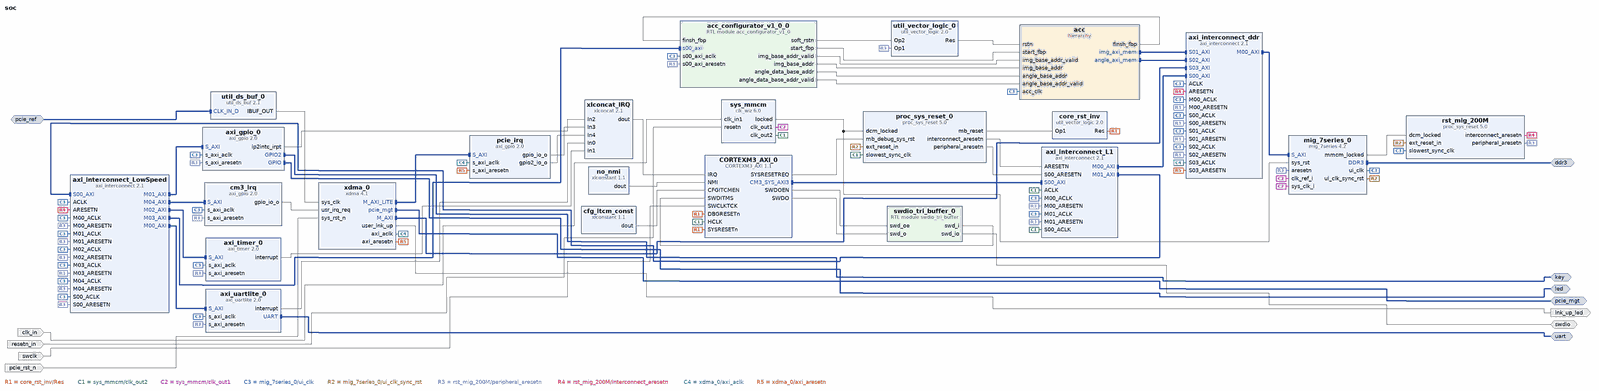
[diagram p0: block diagram of the top level, whole]
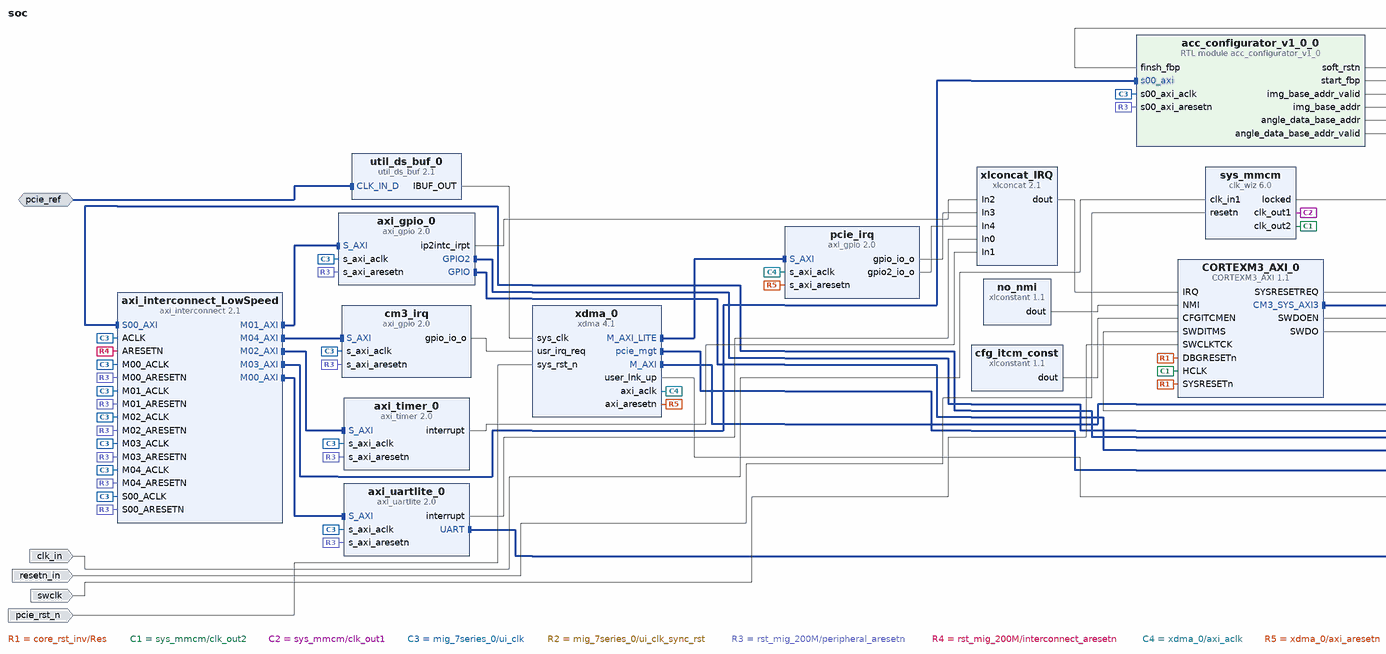
[diagram p1: block diagram of the top level, left part]
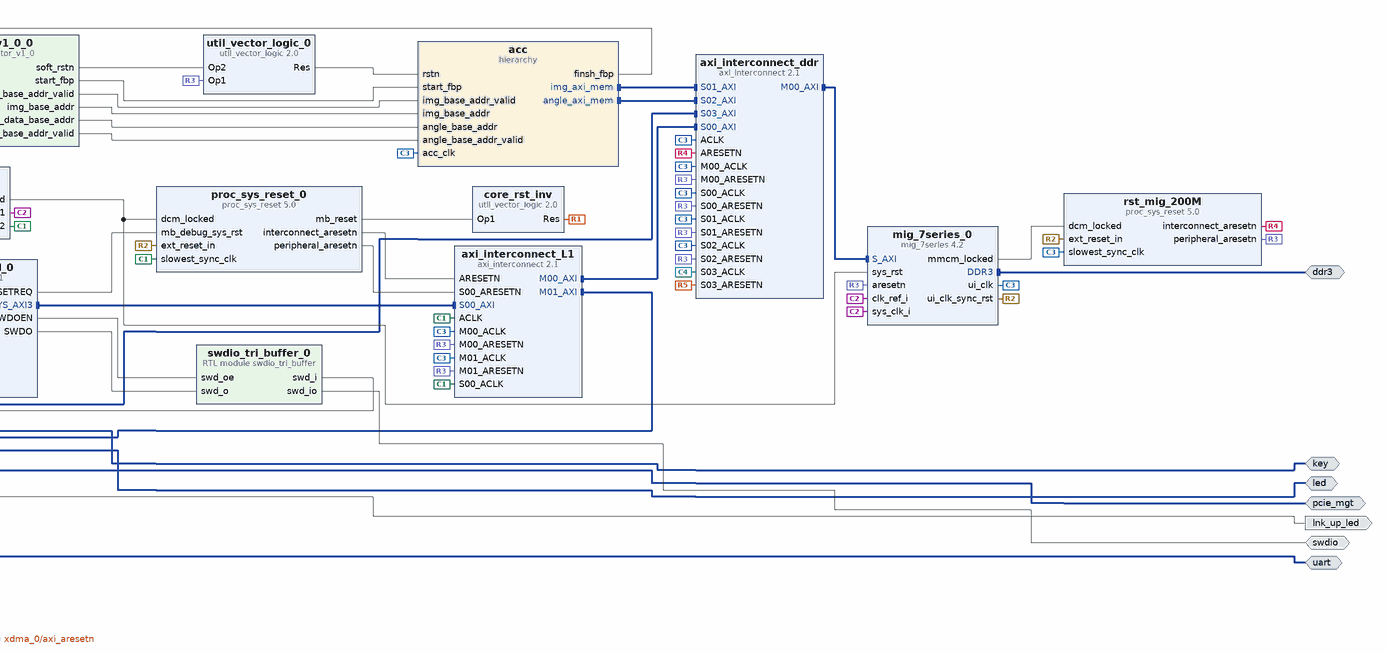
[diagram p2: block diagram of the top level, right part]
# Vivado block design soc, xc7k325tffg676-2, Vivado 2020.2
create_bd_design soc

create_bd_intf_port -mode Master -vlnv xilinx.com:interface:ddrx_rtl:1.0 ddr3
create_bd_intf_port -mode Master -vlnv xilinx.com:interface:pcie_7x_mgt_rtl:1.0 pcie_mgt
create_bd_intf_port -mode Slave -vlnv xilinx.com:interface:diff_clock_rtl:1.0 pcie_ref
set_property -dict {CONFIG.FREQ_HZ 100000000} [get_bd_intf_ports pcie_ref]
create_bd_intf_port -mode Master -vlnv xilinx.com:interface:gpio_rtl:1.0 led
create_bd_intf_port -mode Master -vlnv xilinx.com:interface:gpio_rtl:1.0 key
create_bd_intf_port -mode Master -vlnv xilinx.com:interface:uart_rtl:1.0 uart
create_bd_port -dir I -type clk clk_in
set_property -dict {CONFIG.ASSOCIATED_RESET pcie_rst_n CONFIG.FREQ_HZ 50000000} [get_bd_ports clk_in]
create_bd_port -dir I -type rst resetn_in
create_bd_port -dir I -type clk swclk
create_bd_port -dir IO swdio
create_bd_port -dir O lnk_up_led
create_bd_port -dir I -type rst pcie_rst_n
set_property -dict {CONFIG.POLARITY ACTIVE_LOW} [get_bd_ports pcie_rst_n]

create_bd_cell -type hier acc
create_bd_cell -type ip -vlnv Arm.com:CortexM:CORTEXM3_AXI:1.1 CORTEXM3_AXI_0
set_property -dict [list \
  CONFIG.DTCM_SIZE {"0111"} \
  CONFIG.ITCM_INIT_RAM false \
  CONFIG.ITCM_SIZE {"0111"} \
  CONFIG.JTAG_PRESENT false \
  CONFIG.TRACE_LVL 0 \
] [get_bd_cells CORTEXM3_AXI_0]
create_bd_cell -type module -reference acc_configurator_v1_0 acc_configurator_v1_0_0
create_bd_cell -type ip -vlnv xilinx.com:ip:axi_gpio:2.0 cm3_irq
set_property -dict {CONFIG.C_ALL_OUTPUTS 1 CONFIG.C_GPIO_WIDTH 2 CONFIG.C_IS_DUAL 0} [get_bd_cells cm3_irq]
create_bd_cell -type ip -vlnv xilinx.com:ip:axi_gpio:2.0 axi_gpio_0
set_property -dict [list \
  CONFIG.C_ALL_INPUTS_2 1 \
  CONFIG.C_ALL_OUTPUTS 1 \
  CONFIG.C_GPIO2_WIDTH 4 \
  CONFIG.C_GPIO_WIDTH 7 \
  CONFIG.C_INTERRUPT_PRESENT 1 \
  CONFIG.C_IS_DUAL 1 \
] [get_bd_cells axi_gpio_0]
create_bd_cell -type ip -vlnv xilinx.com:ip:axi_interconnect:2.1 axi_interconnect_L1
create_bd_cell -type ip -vlnv xilinx.com:ip:axi_interconnect:2.1 axi_interconnect_ddr
set_property -dict [list \
  CONFIG.NUM_MI 1 \
  CONFIG.NUM_SI 4 \
  CONFIG.S00_HAS_DATA_FIFO 2 \
  CONFIG.S01_HAS_DATA_FIFO 2 \
  CONFIG.S02_HAS_DATA_FIFO 2 \
  CONFIG.S03_HAS_DATA_FIFO 2 \
  CONFIG.STRATEGY 0 \
] [get_bd_cells axi_interconnect_ddr]
create_bd_cell -type ip -vlnv xilinx.com:ip:axi_timer:2.0 axi_timer_0
create_bd_cell -type ip -vlnv xilinx.com:ip:axi_uartlite:2.0 axi_uartlite_0
set_property -dict {CONFIG.C_BAUDRATE 115200} [get_bd_cells axi_uartlite_0]
create_bd_cell -type ip -vlnv xilinx.com:ip:clk_wiz:6.0 sys_mmcm
set_property -dict [list \
  CONFIG.CLKIN1_JITTER_PS 200.0 \
  CONFIG.CLKOUT1_JITTER 142.107 \
  CONFIG.CLKOUT1_PHASE_ERROR 164.985 \
  CONFIG.CLKOUT1_REQUESTED_OUT_FREQ 200.000 \
  CONFIG.CLKOUT2_JITTER 192.113 \
  CONFIG.CLKOUT2_PHASE_ERROR 164.985 \
  CONFIG.CLKOUT2_REQUESTED_OUT_FREQ 50.000 \
  CONFIG.CLKOUT2_USED true \
  CONFIG.MMCM_CLKFBOUT_MULT_F 20.000 \
  CONFIG.MMCM_CLKIN1_PERIOD 20.000 \
  CONFIG.MMCM_CLKIN2_PERIOD 10.0 \
  CONFIG.MMCM_CLKOUT0_DIVIDE_F 5.000 \
  CONFIG.MMCM_CLKOUT1_DIVIDE 20 \
  CONFIG.NUM_OUT_CLKS 2 \
  CONFIG.PRIM_IN_FREQ 50.000 \
  CONFIG.RESET_PORT resetn \
  CONFIG.RESET_TYPE ACTIVE_LOW \
] [get_bd_cells sys_mmcm]
create_bd_cell -type ip -vlnv xilinx.com:ip:proc_sys_reset:5.0 proc_sys_reset_0
create_bd_cell -type ip -vlnv xilinx.com:ip:proc_sys_reset:5.0 rst_mig_200M
create_bd_cell -type module -reference swdio_tri_buffer swdio_tri_buffer_0
create_bd_cell -type ip -vlnv xilinx.com:ip:util_vector_logic:2.0 core_rst_inv
set_property -dict {CONFIG.C_OPERATION not CONFIG.C_SIZE 1} [get_bd_cells core_rst_inv]
create_bd_cell -type ip -vlnv xilinx.com:ip:util_vector_logic:2.0 util_vector_logic_0
set_property -dict {CONFIG.C_OPERATION and CONFIG.C_SIZE 1} [get_bd_cells util_vector_logic_0]
create_bd_cell -type ip -vlnv xilinx.com:ip:xlconcat:2.1 xlconcat_IRQ
set_property -dict {CONFIG.NUM_PORTS 5 CONFIG.dout_width 5} [get_bd_cells xlconcat_IRQ]
create_bd_cell -type ip -vlnv xilinx.com:ip:xlconstant:1.1 no_nmi
set_property -dict {CONFIG.CONST_VAL 0} [get_bd_cells no_nmi]
create_bd_cell -type ip -vlnv xilinx.com:ip:xlconstant:1.1 cfg_itcm_const
set_property -dict {CONFIG.CONST_WIDTH 2} [get_bd_cells cfg_itcm_const]
create_bd_cell -type ip -vlnv xilinx.com:ip:mig_7series:4.2 mig_7series_0
set_property -dict [list \
  CONFIG.BOARD_MIG_PARAM Custom \
  CONFIG.RESET_BOARD_INTERFACE Custom \
  CONFIG.XML_INPUT_FILE mig_a.prj \
] [get_bd_cells mig_7series_0]
create_bd_cell -type ip -vlnv xilinx.com:ip:util_ds_buf:2.1 util_ds_buf_0
set_property -dict {CONFIG.C_BUF_TYPE IBUFDSGTE} [get_bd_cells util_ds_buf_0]
create_bd_cell -type ip -vlnv xilinx.com:ip:xdma:4.1 xdma_0
set_property -dict [list \
  CONFIG.PF0_DEVICE_ID_mqdma 9024 \
  CONFIG.PF2_DEVICE_ID_mqdma 9024 \
  CONFIG.PF3_DEVICE_ID_mqdma 9024 \
  CONFIG.axi_data_width 128_bit \
  CONFIG.axilite_master_en true \
  CONFIG.axisten_freq 125 \
  CONFIG.cfg_mgmt_if false \
  CONFIG.pciebar2axibar_axil_master 0x40040000 \
  CONFIG.pf0_device_id 7024 \
  CONFIG.pf0_interrupt_pin NONE \
  CONFIG.pf0_msix_cap_pba_bir BAR_3:2 \
  CONFIG.pf0_msix_cap_pba_offset 00008FE0 \
  CONFIG.pf0_msix_cap_table_bir BAR_3:2 \
  CONFIG.pf0_msix_cap_table_offset 00008000 \
  CONFIG.pf0_msix_cap_table_size 01F \
  CONFIG.pf0_msix_enabled true \
  CONFIG.pl_link_cap_max_link_speed 5.0_GT/s \
  CONFIG.pl_link_cap_max_link_width X4 \
  CONFIG.plltype QPLL1 \
  CONFIG.xdma_axi_intf_mm AXI_Memory_Mapped \
  CONFIG.xdma_num_usr_irq 2 \
  CONFIG.xdma_pcie_64bit_en true \
  CONFIG.xdma_rnum_chnl 2 \
  CONFIG.xdma_wnum_chnl 2 \
] [get_bd_cells xdma_0]
create_bd_cell -type ip -vlnv xilinx.com:ip:axi_gpio:2.0 pcie_irq
set_property -dict [list \
  CONFIG.C_ALL_INPUTS 0 \
  CONFIG.C_ALL_INPUTS_2 0 \
  CONFIG.C_ALL_OUTPUTS 1 \
  CONFIG.C_ALL_OUTPUTS_2 1 \
  CONFIG.C_GPIO2_WIDTH 1 \
  CONFIG.C_GPIO_WIDTH 1 \
  CONFIG.C_IS_DUAL 1 \
] [get_bd_cells pcie_irq]
create_bd_cell -type ip -vlnv xilinx.com:ip:axi_interconnect:2.1 axi_interconnect_LowSpeed
set_property -dict {CONFIG.NUM_MI 5} [get_bd_cells axi_interconnect_LowSpeed]

# ---- hierarchy /acc ----
current_bd_instance /acc
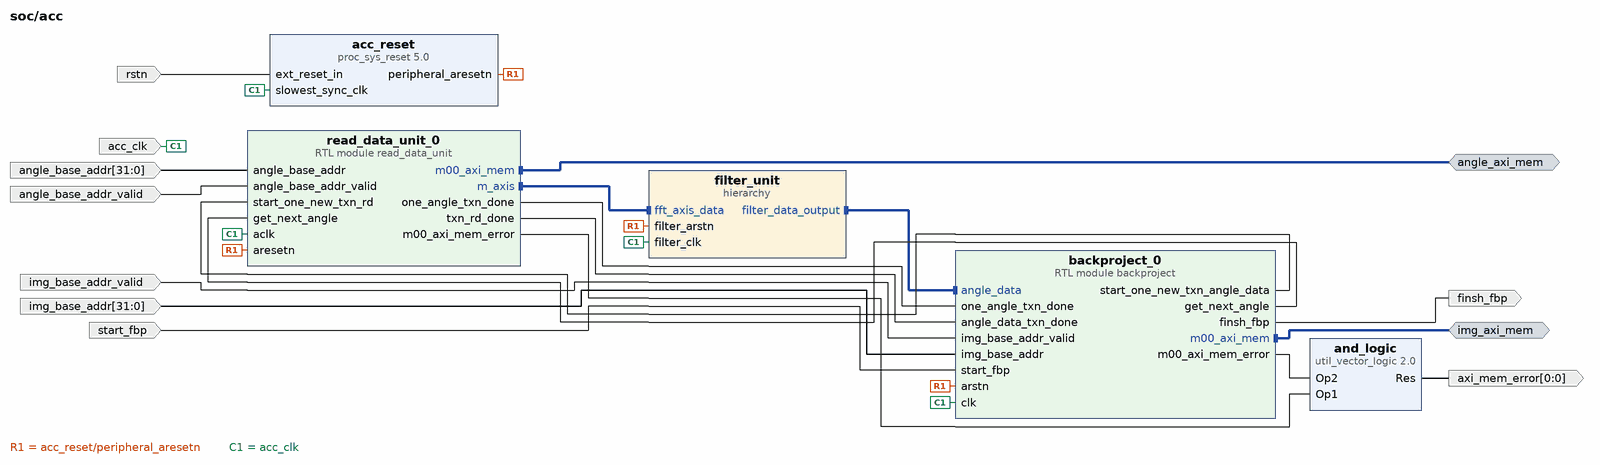
[diagram p3: block diagram inside /acc]
create_bd_intf_pin -mode Master -vlnv xilinx.com:interface:aximm_rtl:1.0 img_axi_mem
create_bd_intf_pin -mode Master -vlnv xilinx.com:interface:aximm_rtl:1.0 angle_axi_mem
create_bd_pin -dir I -type clk acc_clk
create_bd_pin -dir I img_base_addr_valid
create_bd_pin -dir I -from 31 -to 0 img_base_addr
create_bd_pin -dir I start_fbp
create_bd_pin -dir O finsh_fbp
create_bd_pin -dir I -from 31 -to 0 angle_base_addr
create_bd_pin -dir I angle_base_addr_valid
create_bd_pin -dir I -type rst rstn
create_bd_pin -dir O -from 0 -to 0 axi_mem_error

create_bd_cell -type hier filter_unit
create_bd_cell -type ip -vlnv xilinx.com:ip:proc_sys_reset:5.0 acc_reset
create_bd_cell -type ip -vlnv xilinx.com:ip:util_vector_logic:2.0 and_logic
set_property -dict {CONFIG.C_SIZE 1} [get_bd_cells and_logic]
create_bd_cell -type module -reference read_data_unit read_data_unit_0
create_bd_cell -type module -reference backproject backproject_0

# ---- hierarchy /acc/filter_unit ----
current_bd_instance /acc/filter_unit
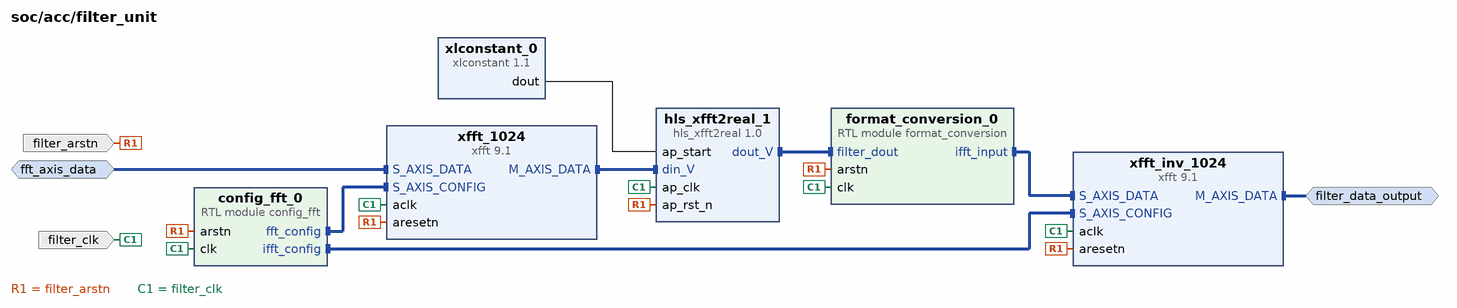
[diagram p4: block diagram inside /acc/filter_unit]
create_bd_intf_pin -mode Master -vlnv xilinx.com:interface:axis_rtl:1.0 filter_data_output
create_bd_intf_pin -mode Slave -vlnv xilinx.com:interface:axis_rtl:1.0 fft_axis_data
create_bd_pin -dir I -type rst filter_arstn
create_bd_pin -dir I -type clk filter_clk

create_bd_cell -type module -reference config_fft config_fft_0
create_bd_cell -type ip -vlnv xilinx.com:ip:xfft:9.1 xfft_1024
set_property -dict [list \
  CONFIG.aresetn true \
  CONFIG.implementation_options pipelined_streaming_io \
  CONFIG.input_width 32 \
  CONFIG.number_of_stages_using_block_ram_for_data_and_phase_factors 3 \
  CONFIG.phase_factor_width 24 \
  CONFIG.transform_length 1024 \
] [get_bd_cells xfft_1024]
create_bd_cell -type ip -vlnv xilinx.com:ip:xfft:9.1 xfft_inv_1024
set_property -dict [list \
  CONFIG.aresetn true \
  CONFIG.implementation_options pipelined_streaming_io \
  CONFIG.input_width 32 \
  CONFIG.number_of_stages_using_block_ram_for_data_and_phase_factors 3 \
  CONFIG.output_ordering natural_order \
  CONFIG.phase_factor_width 24 \
  CONFIG.transform_length 1024 \
] [get_bd_cells xfft_inv_1024]
create_bd_cell -type ip -vlnv xilinx.com:ip:xlconstant:1.1 xlconstant_0
create_bd_cell -type module -reference format_conversion format_conversion_0
create_bd_cell -type ip -vlnv xilinx.com:hls:hls_xfft2real:1.0 hls_xfft2real_1

# ---- connections ----

current_bd_instance /acc
connect_bd_intf_net [get_bd_intf_pins angle_axi_mem] [get_bd_intf_pins read_data_unit_0/m00_axi_mem]
connect_bd_intf_net -intf_net xfft_inv_512_M_AXIS_DATA [get_bd_intf_pins filter_unit/filter_data_output] [get_bd_intf_pins backproject_0/angle_data]
connect_bd_intf_net [get_bd_intf_pins img_axi_mem] [get_bd_intf_pins backproject_0/m00_axi_mem]
connect_bd_intf_net [get_bd_intf_pins read_data_unit_0/m_axis] [get_bd_intf_pins filter_unit/fft_axis_data]
connect_bd_net -net proc_sys_reset_0_peripheral_aresetn [get_bd_pins acc_reset/peripheral_aresetn] \
  [get_bd_pins filter_unit/filter_arstn] [get_bd_pins read_data_unit_0/aresetn] [get_bd_pins backproject_0/arstn]
connect_bd_net [get_bd_pins backproject_0/start_one_new_txn_angle_data] [get_bd_pins read_data_unit_0/start_one_new_txn_rd]
connect_bd_net [get_bd_pins backproject_0/get_next_angle] [get_bd_pins read_data_unit_0/get_next_angle]
connect_bd_net [get_bd_pins read_data_unit_0/one_angle_txn_done] [get_bd_pins backproject_0/one_angle_txn_done]
connect_bd_net [get_bd_pins read_data_unit_0/txn_rd_done] [get_bd_pins backproject_0/angle_data_txn_done]
connect_bd_net [get_bd_pins backproject_0/m00_axi_mem_error] [get_bd_pins and_logic/Op2]
connect_bd_net [get_bd_pins read_data_unit_0/m00_axi_mem_error] [get_bd_pins and_logic/Op1]
connect_bd_net -net aclk_0_1 [get_bd_pins acc_clk] \
  [get_bd_pins filter_unit/filter_clk] [get_bd_pins acc_reset/slowest_sync_clk] [get_bd_pins read_data_unit_0/aclk] \
  [get_bd_pins backproject_0/clk]
connect_bd_net -net img_base_addr_valid_0_1 [get_bd_pins img_base_addr_valid] [get_bd_pins backproject_0/img_base_addr_valid]
connect_bd_net -net img_base_addr_0_1 [get_bd_pins img_base_addr] [get_bd_pins backproject_0/img_base_addr]
connect_bd_net -net start_fbp_0_1 [get_bd_pins start_fbp] [get_bd_pins backproject_0/start_fbp]
connect_bd_net [get_bd_pins backproject_0/finsh_fbp] [get_bd_pins finsh_fbp]
connect_bd_net -net angle_base_addr_0_1 [get_bd_pins angle_base_addr] [get_bd_pins read_data_unit_0/angle_base_addr]
connect_bd_net -net angle_base_addr_valid_0_1 [get_bd_pins angle_base_addr_valid] [get_bd_pins read_data_unit_0/angle_base_addr_valid]
connect_bd_net -net ext_reset_in_0_1 [get_bd_pins rstn] [get_bd_pins acc_reset/ext_reset_in]
connect_bd_net -net util_vector_logic_0_Res [get_bd_pins and_logic/Res] [get_bd_pins axi_mem_error]

current_bd_instance /acc/filter_unit
connect_bd_intf_net [get_bd_intf_pins config_fft_0/fft_config] [get_bd_intf_pins xfft_1024/S_AXIS_CONFIG]
connect_bd_intf_net [get_bd_intf_pins format_conversion_0/ifft_input] [get_bd_intf_pins xfft_inv_1024/S_AXIS_DATA]
connect_bd_intf_net [get_bd_intf_pins config_fft_0/ifft_config] [get_bd_intf_pins xfft_inv_1024/S_AXIS_CONFIG]
connect_bd_intf_net [get_bd_intf_pins fft_axis_data] [get_bd_intf_pins xfft_1024/S_AXIS_DATA]
connect_bd_intf_net -intf_net xfft_512_M_AXIS_DATA [get_bd_intf_pins xfft_1024/M_AXIS_DATA] [get_bd_intf_pins hls_xfft2real_1/din_V]
connect_bd_intf_net -intf_net hls_filter2ifft_0_dout_V [get_bd_intf_pins hls_xfft2real_1/dout_V] [get_bd_intf_pins format_conversion_0/filter_dout]
connect_bd_intf_net -intf_net xfft_inv_512_M_AXIS_DATA [get_bd_intf_pins filter_data_output] [get_bd_intf_pins xfft_inv_1024/M_AXIS_DATA]
connect_bd_net [get_bd_pins xlconstant_0/dout] [get_bd_pins hls_xfft2real_1/ap_start]
connect_bd_net -net proc_sys_reset_0_peripheral_aresetn [get_bd_pins filter_arstn] \
  [get_bd_pins config_fft_0/arstn] [get_bd_pins xfft_1024/aresetn] [get_bd_pins xfft_inv_1024/aresetn] \
  [get_bd_pins hls_xfft2real_1/ap_rst_n] [get_bd_pins format_conversion_0/arstn]
connect_bd_net -net aclk_0_1 [get_bd_pins filter_clk] \
  [get_bd_pins config_fft_0/clk] [get_bd_pins xfft_1024/aclk] [get_bd_pins xfft_inv_1024/aclk] \
  [get_bd_pins hls_xfft2real_1/ap_clk] [get_bd_pins format_conversion_0/clk]

current_bd_instance /
connect_bd_intf_net [get_bd_intf_pins axi_interconnect_ddr/S00_AXI] [get_bd_intf_pins axi_interconnect_L1/M00_AXI]
connect_bd_intf_net [get_bd_intf_ports key] [get_bd_intf_pins axi_gpio_0/GPIO2]
connect_bd_intf_net [get_bd_intf_ports ddr3] [get_bd_intf_pins mig_7series_0/DDR3]
connect_bd_intf_net [get_bd_intf_ports pcie_mgt] [get_bd_intf_pins xdma_0/pcie_mgt]
connect_bd_intf_net [get_bd_intf_pins axi_gpio_0/S_AXI] [get_bd_intf_pins axi_interconnect_LowSpeed/M01_AXI]
connect_bd_intf_net [get_bd_intf_pins xdma_0/M_AXI_LITE] [get_bd_intf_pins pcie_irq/S_AXI]
connect_bd_intf_net [get_bd_intf_pins xdma_0/M_AXI] [get_bd_intf_pins axi_interconnect_ddr/S03_AXI]
connect_bd_intf_net [get_bd_intf_pins axi_interconnect_L1/M01_AXI] [get_bd_intf_pins axi_interconnect_LowSpeed/S00_AXI]
connect_bd_intf_net [get_bd_intf_ports uart] [get_bd_intf_pins axi_uartlite_0/UART]
connect_bd_intf_net [get_bd_intf_pins axi_interconnect_ddr/M00_AXI] [get_bd_intf_pins mig_7series_0/S_AXI]
connect_bd_intf_net [get_bd_intf_pins acc/img_axi_mem] [get_bd_intf_pins axi_interconnect_ddr/S01_AXI]
connect_bd_intf_net [get_bd_intf_pins acc/angle_axi_mem] [get_bd_intf_pins axi_interconnect_ddr/S02_AXI]
connect_bd_intf_net [get_bd_intf_pins axi_uartlite_0/S_AXI] [get_bd_intf_pins axi_interconnect_LowSpeed/M00_AXI]
connect_bd_intf_net [get_bd_intf_pins CORTEXM3_AXI_0/CM3_SYS_AXI3] [get_bd_intf_pins axi_interconnect_L1/S00_AXI]
connect_bd_intf_net [get_bd_intf_ports led] [get_bd_intf_pins axi_gpio_0/GPIO]
connect_bd_intf_net [get_bd_intf_pins axi_timer_0/S_AXI] [get_bd_intf_pins axi_interconnect_LowSpeed/M02_AXI]
connect_bd_intf_net [get_bd_intf_pins axi_interconnect_LowSpeed/M04_AXI] [get_bd_intf_pins cm3_irq/S_AXI]
connect_bd_intf_net -intf_net diff_clock_rtl_0_1 [get_bd_intf_ports pcie_ref] [get_bd_intf_pins util_ds_buf_0/CLK_IN_D]
connect_bd_intf_net [get_bd_intf_pins acc_configurator_v1_0_0/s00_axi] [get_bd_intf_pins axi_interconnect_LowSpeed/M03_AXI]
connect_bd_net [get_bd_pins core_rst_inv/Res] [get_bd_pins CORTEXM3_AXI_0/SYSRESETn] [get_bd_pins CORTEXM3_AXI_0/DBGRESETn]
connect_bd_net [get_bd_pins proc_sys_reset_0/mb_reset] [get_bd_pins core_rst_inv/Op1]
connect_bd_net [get_bd_pins CORTEXM3_AXI_0/SYSRESETREQ] [get_bd_pins proc_sys_reset_0/mb_debug_sys_rst]
connect_bd_net -net clk_in1_0_1 [get_bd_ports clk_in] [get_bd_pins sys_mmcm/clk_in1]
connect_bd_net -net resetn_0_1 [get_bd_ports resetn_in] [get_bd_pins sys_mmcm/resetn]
connect_bd_net [get_bd_pins sys_mmcm/clk_out2] \
  [get_bd_pins CORTEXM3_AXI_0/HCLK] [get_bd_pins axi_interconnect_L1/ACLK] [get_bd_pins axi_interconnect_L1/S00_ACLK] \
  [get_bd_pins proc_sys_reset_0/slowest_sync_clk]
connect_bd_net [get_bd_pins sys_mmcm/locked] [get_bd_pins proc_sys_reset_0/dcm_locked] [get_bd_pins mig_7series_0/sys_rst]
connect_bd_net -net xlconstant_0_dout [get_bd_pins no_nmi/dout] [get_bd_pins CORTEXM3_AXI_0/NMI]
connect_bd_net [get_bd_pins cfg_itcm_const/dout] [get_bd_pins CORTEXM3_AXI_0/CFGITCMEN]
connect_bd_net -net SWCLKTCK_0_1 [get_bd_ports swclk] [get_bd_pins CORTEXM3_AXI_0/SWCLKTCK]
connect_bd_net [get_bd_pins CORTEXM3_AXI_0/SWDOEN] [get_bd_pins swdio_tri_buffer_0/swd_oe]
connect_bd_net [get_bd_pins CORTEXM3_AXI_0/SWDO] [get_bd_pins swdio_tri_buffer_0/swd_o]
connect_bd_net [get_bd_pins swdio_tri_buffer_0/swd_i] [get_bd_pins CORTEXM3_AXI_0/SWDITMS]
connect_bd_net [get_bd_ports swdio] [get_bd_pins swdio_tri_buffer_0/swd_io]
connect_bd_net -net xlconcat_0_dout [get_bd_pins xlconcat_IRQ/dout] [get_bd_pins CORTEXM3_AXI_0/IRQ]
connect_bd_net -net ARESETN_1 [get_bd_pins proc_sys_reset_0/interconnect_aresetn] [get_bd_pins axi_interconnect_L1/ARESETN]
connect_bd_net -net S00_ARESETN_1 [get_bd_pins proc_sys_reset_0/peripheral_aresetn] [get_bd_pins axi_interconnect_L1/S00_ARESETN]
connect_bd_net [get_bd_pins sys_mmcm/clk_out1] [get_bd_pins mig_7series_0/sys_clk_i] [get_bd_pins mig_7series_0/clk_ref_i]
connect_bd_net [get_bd_pins mig_7series_0/ui_clk] \
  [get_bd_pins acc/acc_clk] [get_bd_pins acc_configurator_v1_0_0/s00_axi_aclk] [get_bd_pins cm3_irq/s_axi_aclk] \
  [get_bd_pins axi_gpio_0/s_axi_aclk] [get_bd_pins axi_interconnect_L1/M00_ACLK] [get_bd_pins axi_interconnect_L1/M01_ACLK] \
  [get_bd_pins axi_interconnect_ddr/ACLK] [get_bd_pins axi_interconnect_ddr/S00_ACLK] \
  [get_bd_pins axi_interconnect_ddr/M00_ACLK] [get_bd_pins axi_interconnect_ddr/S01_ACLK] \
  [get_bd_pins axi_interconnect_ddr/S02_ACLK] [get_bd_pins axi_timer_0/s_axi_aclk] [get_bd_pins axi_uartlite_0/s_axi_aclk] \
  [get_bd_pins rst_mig_200M/slowest_sync_clk] [get_bd_pins axi_interconnect_LowSpeed/ACLK] \
  [get_bd_pins axi_interconnect_LowSpeed/S00_ACLK] [get_bd_pins axi_interconnect_LowSpeed/M00_ACLK] \
  [get_bd_pins axi_interconnect_LowSpeed/M01_ACLK] [get_bd_pins axi_interconnect_LowSpeed/M02_ACLK] \
  [get_bd_pins axi_interconnect_LowSpeed/M03_ACLK] [get_bd_pins axi_interconnect_LowSpeed/M04_ACLK]
connect_bd_net [get_bd_pins mig_7series_0/ui_clk_sync_rst] [get_bd_pins proc_sys_reset_0/ext_reset_in] [get_bd_pins rst_mig_200M/ext_reset_in]
connect_bd_net [get_bd_pins mig_7series_0/mmcm_locked] [get_bd_pins rst_mig_200M/dcm_locked]
connect_bd_net -net M00_ARESETN_1 [get_bd_pins rst_mig_200M/peripheral_aresetn] \
  [get_bd_pins acc_configurator_v1_0_0/s00_axi_aresetn] [get_bd_pins cm3_irq/s_axi_aresetn] \
  [get_bd_pins axi_gpio_0/s_axi_aresetn] [get_bd_pins axi_interconnect_L1/M00_ARESETN] \
  [get_bd_pins axi_interconnect_L1/M01_ARESETN] [get_bd_pins axi_interconnect_ddr/S00_ARESETN] \
  [get_bd_pins axi_interconnect_ddr/M00_ARESETN] [get_bd_pins axi_interconnect_ddr/S01_ARESETN] \
  [get_bd_pins axi_interconnect_ddr/S02_ARESETN] [get_bd_pins axi_timer_0/s_axi_aresetn] \
  [get_bd_pins axi_uartlite_0/s_axi_aresetn] [get_bd_pins util_vector_logic_0/Op1] \
  [get_bd_pins axi_interconnect_LowSpeed/S00_ARESETN] [get_bd_pins axi_interconnect_LowSpeed/M00_ARESETN] \
  [get_bd_pins axi_interconnect_LowSpeed/M01_ARESETN] [get_bd_pins axi_interconnect_LowSpeed/M02_ARESETN] \
  [get_bd_pins axi_interconnect_LowSpeed/M03_ARESETN] [get_bd_pins axi_interconnect_LowSpeed/M04_ARESETN] \
  [get_bd_pins mig_7series_0/aresetn]
connect_bd_net -net ARESETN_2 [get_bd_pins rst_mig_200M/interconnect_aresetn] \
  [get_bd_pins axi_interconnect_ddr/ARESETN] [get_bd_pins axi_interconnect_LowSpeed/ARESETN]
connect_bd_net [get_bd_pins util_vector_logic_0/Res] [get_bd_pins acc/rstn]
connect_bd_net [get_bd_pins acc/finsh_fbp] [get_bd_pins acc_configurator_v1_0_0/finsh_fbp]
connect_bd_net [get_bd_pins acc_configurator_v1_0_0/start_fbp] [get_bd_pins acc/start_fbp]
connect_bd_net -net img_base_addr_valid_1 [get_bd_pins acc_configurator_v1_0_0/img_base_addr_valid] [get_bd_pins acc/img_base_addr_valid]
connect_bd_net -net img_base_addr_1 [get_bd_pins acc_configurator_v1_0_0/img_base_addr] [get_bd_pins acc/img_base_addr]
connect_bd_net -net angle_base_addr_1 [get_bd_pins acc_configurator_v1_0_0/angle_data_base_addr] [get_bd_pins acc/angle_base_addr]
connect_bd_net -net angle_base_addr_valid_1 [get_bd_pins acc_configurator_v1_0_0/angle_data_base_addr_valid] [get_bd_pins acc/angle_base_addr_valid]
connect_bd_net [get_bd_pins acc_configurator_v1_0_0/soft_rstn] [get_bd_pins util_vector_logic_0/Op2]
connect_bd_net [get_bd_pins xdma_0/axi_aclk] [get_bd_pins axi_interconnect_ddr/S03_ACLK] [get_bd_pins pcie_irq/s_axi_aclk]
connect_bd_net [get_bd_pins xdma_0/axi_aresetn] [get_bd_pins axi_interconnect_ddr/S03_ARESETN] [get_bd_pins pcie_irq/s_axi_aresetn]
connect_bd_net [get_bd_pins xdma_0/user_lnk_up] [get_bd_ports lnk_up_led]
connect_bd_net [get_bd_pins pcie_irq/gpio_io_o] [get_bd_pins xlconcat_IRQ/In3]
connect_bd_net [get_bd_pins pcie_irq/gpio2_io_o] [get_bd_pins xlconcat_IRQ/In4]
connect_bd_net [get_bd_pins cm3_irq/gpio_io_o] [get_bd_pins xdma_0/usr_irq_req]
connect_bd_net [get_bd_pins axi_uartlite_0/interrupt] [get_bd_pins xlconcat_IRQ/In0]
connect_bd_net [get_bd_pins axi_timer_0/interrupt] [get_bd_pins xlconcat_IRQ/In1]
connect_bd_net [get_bd_pins axi_gpio_0/ip2intc_irpt] [get_bd_pins xlconcat_IRQ/In2]
connect_bd_net -net sys_rst_n_0_1 [get_bd_ports pcie_rst_n] [get_bd_pins xdma_0/sys_rst_n]
connect_bd_net -net util_ds_buf_1_IBUF_OUT [get_bd_pins util_ds_buf_0/IBUF_OUT] [get_bd_pins xdma_0/sys_clk]

# ---- address map ----
assign_bd_address -offset 0x80000000 -range 1G -target_address_space [get_bd_addr_spaces acc/backproject_0/m00_axi_mem] [get_bd_addr_segs mig_7series_0/memmap/memaddr]
assign_bd_address -offset 0x80000000 -range 1G -target_address_space [get_bd_addr_spaces acc/read_data_unit_0/m00_axi_mem] [get_bd_addr_segs mig_7series_0/memmap/memaddr]
assign_bd_address -offset 0x40000000 -range 64K -target_address_space [get_bd_addr_spaces CORTEXM3_AXI_0/CM3_SYS_AXI3] [get_bd_addr_segs axi_gpio_0/S_AXI/Reg]
assign_bd_address -offset 0x40010000 -range 64K -target_address_space [get_bd_addr_spaces CORTEXM3_AXI_0/CM3_SYS_AXI3] [get_bd_addr_segs axi_uartlite_0/S_AXI/Reg]
assign_bd_address -offset 0x40020000 -range 64K -target_address_space [get_bd_addr_spaces CORTEXM3_AXI_0/CM3_SYS_AXI3] [get_bd_addr_segs axi_timer_0/S_AXI/Reg]
assign_bd_address -offset 0x40030000 -range 64K -target_address_space [get_bd_addr_spaces CORTEXM3_AXI_0/CM3_SYS_AXI3] [get_bd_addr_segs acc_configurator_v1_0_0/s00_axi/reg0]
assign_bd_address -offset 0x40040000 -range 64K -target_address_space [get_bd_addr_spaces CORTEXM3_AXI_0/CM3_SYS_AXI3] [get_bd_addr_segs cm3_irq/S_AXI/Reg]
assign_bd_address -offset 0x80000000 -range 1G -target_address_space [get_bd_addr_spaces CORTEXM3_AXI_0/CM3_SYS_AXI3] [get_bd_addr_segs mig_7series_0/memmap/memaddr]
assign_bd_address -offset 0x0000000080000000 -range 1G -target_address_space [get_bd_addr_spaces xdma_0/M_AXI] [get_bd_addr_segs mig_7series_0/memmap/memaddr]
assign_bd_address -offset 0x40040000 -range 64K -target_address_space [get_bd_addr_spaces xdma_0/M_AXI_LITE] [get_bd_addr_segs pcie_irq/S_AXI/Reg]

validate_bd_design
save_bd_design
